# Altium schematic sheet Microcontroller.SchDoc
size A4; SheetNumber: 3; SheetTotal: 5
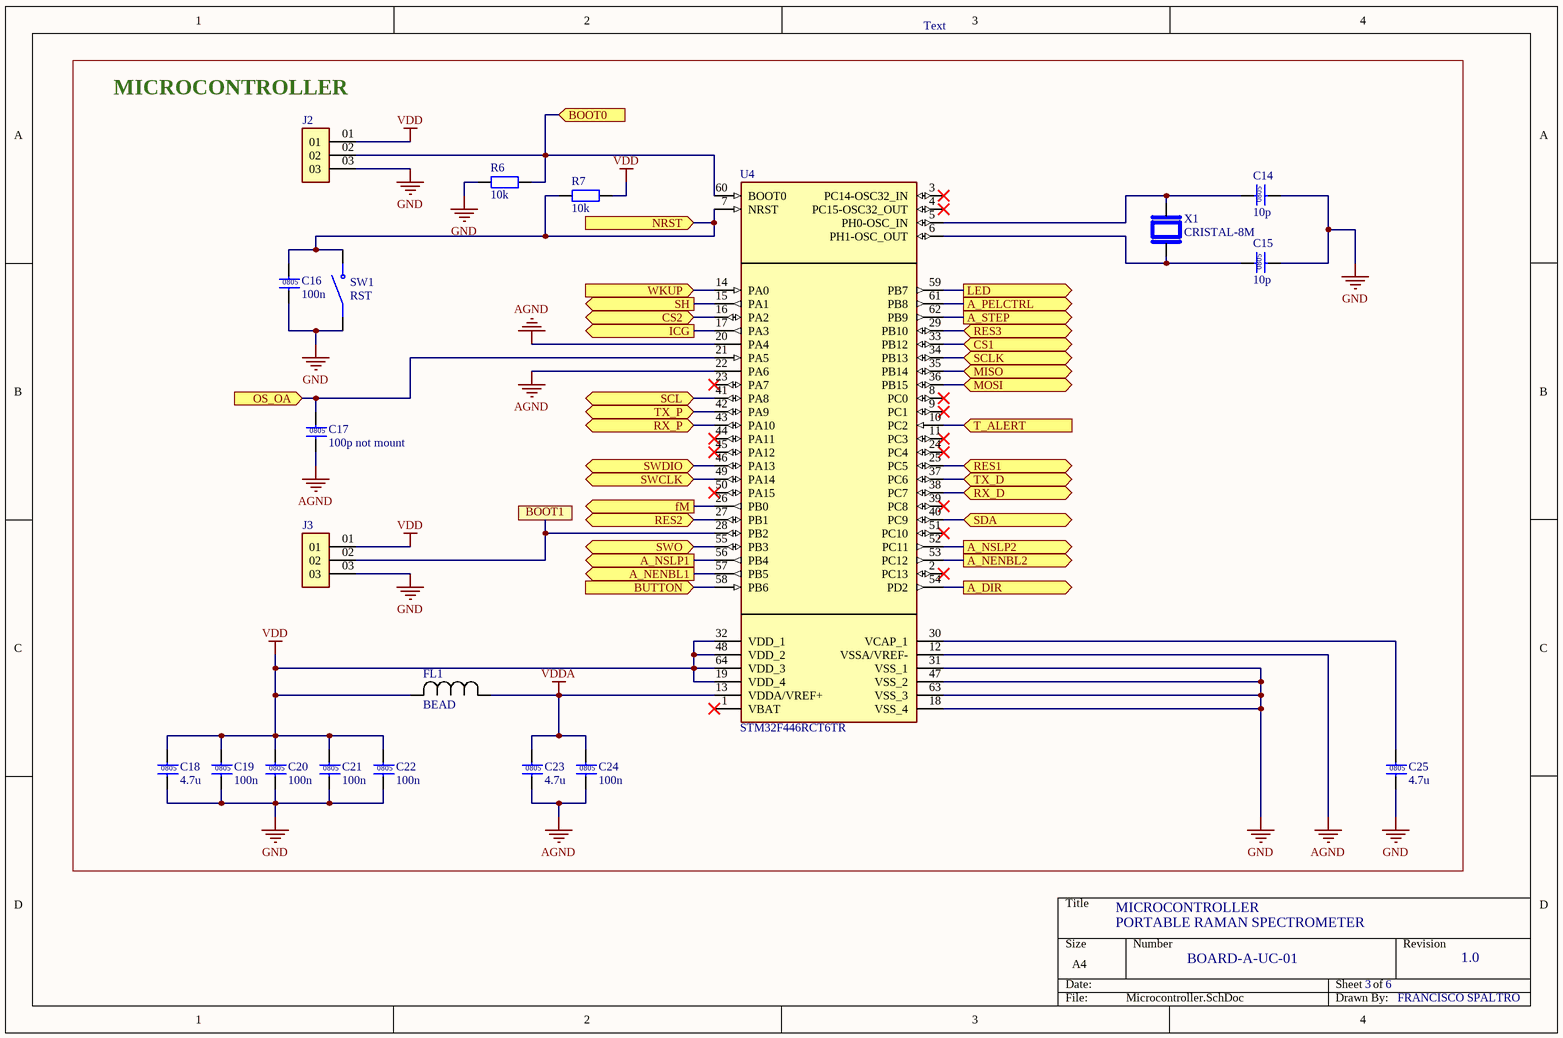
[diagram p0: Microcontroller.SchDoc]

## Parts
C14  10p  [RES_0805]
C15  10p  [RES_0805]
C16  100n  [RES_0805]
C17  100p not mount  [RES_0805]
C18  4.7u  [RES_0805]
C19  100n  [RES_0805]
C20  100n  [RES_0805]
C21  100n  [RES_0805]
C22  100n  [RES_0805]
C23  4.7u  [RES_0805]
C24  100n  [RES_0805]
C25  4.7u  [RES_0805]
FL1  BEAD  [IND_1608_TDK-M]
J2  PIN_HEADER_3  [GEN_PIN3]  (value not drawn)
J3  PIN_HEADER_3  [GEN_PIN3]  (value not drawn)
R6  10k  [RES_0805]
R7  10k  [RES_0805]
SW1  RST  [SW_B3U-1000P]
U4  STM32F446RCT6TR  [QFP50P1200X1200X160-64N]
X1  CRISTAL-8M  [XTALDFN320X250X100-2N]

## Blocks framed on the sheet
MICROCONTROLLER: C14-C25 FL1 J2 J3 R6 R7 SW1 U4 X1

## Ports
A_DIR (out, see Main[1A], Out[4C]), A_NENBL1 (out, see Main[1B], Out[4C]), A_NENBL2 (out, see Main[1B], Out[4C]), A_NSLP1 (out, see Main[1B], Out[4C]), A_NSLP2 (out, see Main[1B], Out[4C]), A_PELCTRL (out, see Main[1B], Out[4C]), A_STEP (out, see Main[1B], Out[4C]), BOOT0 (in, see Main[2B], Out[3D]), BUTTON (in, see Main[2C], Out[1A]), CS1 (bidir, see Main[2B], Out[2B]), CS2 (bidir, see Main[2B], Out[2B]), fM (out, see Main[2C], Out[4A], Sensor[2A]), ICG (out, see Main[2C], Out[4A], Sensor[2A]), LED (out, see Main[2B], Out[1B]), MISO (bidir, see Main[2B], Out[2B]), MOSI (bidir, see Main[2B], Out[2B]), NRST (in, see Main[2B], Out[3B], Out[3C]), OS_OA (in, see Main[1C], Out[4A], Sensor[4B]), RES1 (bidir, see Main[2C], Out[4B]), RES2 (bidir, see Main[2C], Out[4B]), RES3 (bidir, see Main[2C], Out[4B]), RX_D (bidir, see Main[2A], Out[2A]), RX_P (bidir, see Main[2B], Out[2C]), SCL (bidir, see Main[2A], Out[2A], Sensor[1C]), SCLK (bidir, see Main[2B], Out[2B]), SDA (bidir, see Main[2A], Out[2B], Sensor[1C]), SH (out, see Main[1C], Out[4A], Sensor[2A]), SWCLK (bidir, see Main[2B], Out[3B]), SWDIO (bidir, see Main[2B], Out[3B]), SWO (bidir, see Main[2B], Out[3B]), T_ALERT (in, see Main[2C], Sensor[1C]), TX_D (bidir, see Main[2A], Out[2A]), TX_P (bidir, see Main[2B], Out[1C]), WKUP (in, see Main[2B], Out[4B])

## Nets
AGND: C17.2 C23.2 C24.2 U4.12(VSSA/VREF-) U4.20(PA4) U4.22(PA6)
GND: C14.2 C15.2 C16.2 C18.2 C19.2 C20.2 C21.2 C22.2 C25.2 J2.03 J3.03 R6.2 SW1.1 U4.18(VSS_4) U4.31(VSS_1) U4.47(VSS_2) U4.63(VSS_3)
VDD: C18.1 C19.1 C20.1 C21.1 C22.1 FL1.2 J2.01 J3.01 R7.2 U4.19(VDD_4) U4.32(VDD_1) U4.48(VDD_2) U4.64(VDD_3)
VDDA: C23.1 C24.1 FL1.1 U4.13(VDDA/VREF+)
A_DIR: U4.54(PD2) ; port A_DIR
A_NENBL1: U4.57(PB5) ; port A_NENBL1
A_NENBL2: U4.53(PC12) ; port A_NENBL2
A_NSLP1: U4.56(PB4) ; port A_NSLP1
A_NSLP2: U4.52(PC11) ; port A_NSLP2
A_PELCTRL: U4.61(PB8) ; port A_PELCTRL
A_STEP: U4.62(PB9) ; port A_STEP
BOOT0: J2.02 R6.1 U4.60(BOOT0) ; port BOOT0
BOOT1: J3.02 U4.28(PB2)
BUTTON: U4.58(PB6) ; port BUTTON
CS1: U4.33(PB12) ; port CS1
CS2: U4.16(PA2) ; port CS2
fM: U4.26(PB0) ; port fM
ICG: U4.17(PA3) ; port ICG
LED: U4.59(PB7) ; port LED
MISO: U4.35(PB14) ; port MISO
MOSI: U4.36(PB15) ; port MOSI
NRST: C16.1 R7.1 SW1.2 U4.7(NRST) ; port NRST
OS_OA: C17.1 U4.21(PA5) ; port OS_OA
RES1: U4.25(PC5) ; port RES1
RES2: U4.27(PB1) ; port RES2
RES3: U4.29(PB10) ; port RES3
RX_D: U4.38(PC7) ; port RX_D
RX_P: U4.43(PA10) ; port RX_P
SCL: U4.41(PA8) ; port SCL
SCLK: U4.34(PB13) ; port SCLK
SDA: U4.40(PC9) ; port SDA
SH: U4.15(PA1) ; port SH
SWCLK: U4.49(PA14) ; port SWCLK
SWDIO: U4.46(PA13) ; port SWDIO
SWO: U4.55(PB3) ; port SWO
T_ALERT: U4.10(PC2) ; port T_ALERT
TX_D: U4.37(PC6) ; port TX_D
TX_P: U4.42(PA9) ; port TX_P
WKUP: U4.14(PA0) ; port WKUP
NetC14_1: C14.1 U4.5(PH0-OSC_IN) X1.2
NetC15_1: C15.1 U4.6(PH1-OSC_OUT) X1.1
NetC25_1: C25.1 U4.30(VCAP_1)

Not connected (* = marked no-connect by the designer): U4 1(VBAT)* 2(PC13)* 3(PC14-OSC32_IN)* 4(PC15-OSC32_OUT)* 8(PC0)* 9(PC1)* 11(PC3)* 23(PA7)* 24(PC4)* 39(PC8)* 44(PA11)* 45(PA12)* 50(PA15)* 51(PC10)*

## Notes on the sheet
- Text
- MICROCONTROLLER
- PORTABLE RAMAN SPECTROMETER
- BOARD-A-UC-01
- 3
- 6
- 1.0
- FRANCISCO SPALTRO
- (in symbol CAP_0805) 0805

## Library data of the parts
C14 C15 = CAP_0805: Kemet C0805C100J5GACTU
C16 C19-C22 C24 = CAP_0805: Kemet C0805C104K3RAC7800
C17 = CAP_0805: Kemet C0805C101J5GACTU
C18 C23 C25 = CAP_0805: Samsung CL21B475KOFNNNE
FL1 = MMZ1608B601CTAH0: INDUCTOR; SMT (0603); FERRITE-BEAD; 600; TOL=+/-25%; 0.5A; -55 DEGC TO +125 DEGC; Manufacturer_Name: TDK; Copyright: Copyright (C) 2025 Ultra Librarian. All rights reserved.; Manufacturer_Part_Number: MMZ1608B601CTAH0
J2 J3 = PIN_HEADER_3: Generic 40 mils drill size, 100 mils step; MF: Samtec Inc.; MP: TS-103-T-A; SnapEDA_Link: https://www.snapeda.com/parts/TS-103-T-A/Samtec+Inc./view-part/?ref=snap; Package: None; Value: *; Check_prices: https://www.snapeda.com/parts/TS-103-T-A/Samtec+Inc./view-part/?ref=eda
R6 R7 = RES_0805: Generic Capacitor
SW1 = SW-B3U-1000P: Switch Tactile N.O. SPST Round Button Gull Wing 0.05A 12VDC 1.5N SMD Embossed T/R; Price: None; MP: B3U-1000P; Availability: Unavailable; Value: *; Package: None
U4 = STM32F446RCT6TR: ARM® Cortex®-M4 STM32F4 Microcontroller IC 32-Bit Single-Core 180MHz 256KB (256K x 8) FLASH 64-LQFP (10x10); MF: STMicroelectronics; SnapEDA_Link: https://www.snapeda.com/parts/STM32F446RCT6TR/STMicroelectronics/view-part/?ref=snap; Package: LQFP-64 STMicroelectronics; Value: *; MP: STM32F446RCT6TR; Check_prices: https://www.snapeda.com/parts/STM32F446RCT6TR/STMicroelectronics/view-part/?ref=eda
X1 = CRISTAL-CG04874-8M: 8 MHz ±20ppm Crystal 8pF 500 Ohms 2-SMD, No Lead; MF: NDK America, Inc.; SnapEDA_Link: https://www.snapeda.com/parts/CG04874-8M/NDK+America%252C+Inc./view-part/?ref=snap; Package: SMD-2 NDK America,; Value: *; MP: CG04874-8M; Check_prices: https://www.snapeda.com/parts/CG04874-8M/NDK+America%252C+Inc./view-part/?ref=eda